# Altium schematic sheet Precharge circuit.SchDoc
size A4; SheetNumber: 7; SheetTotal: 8
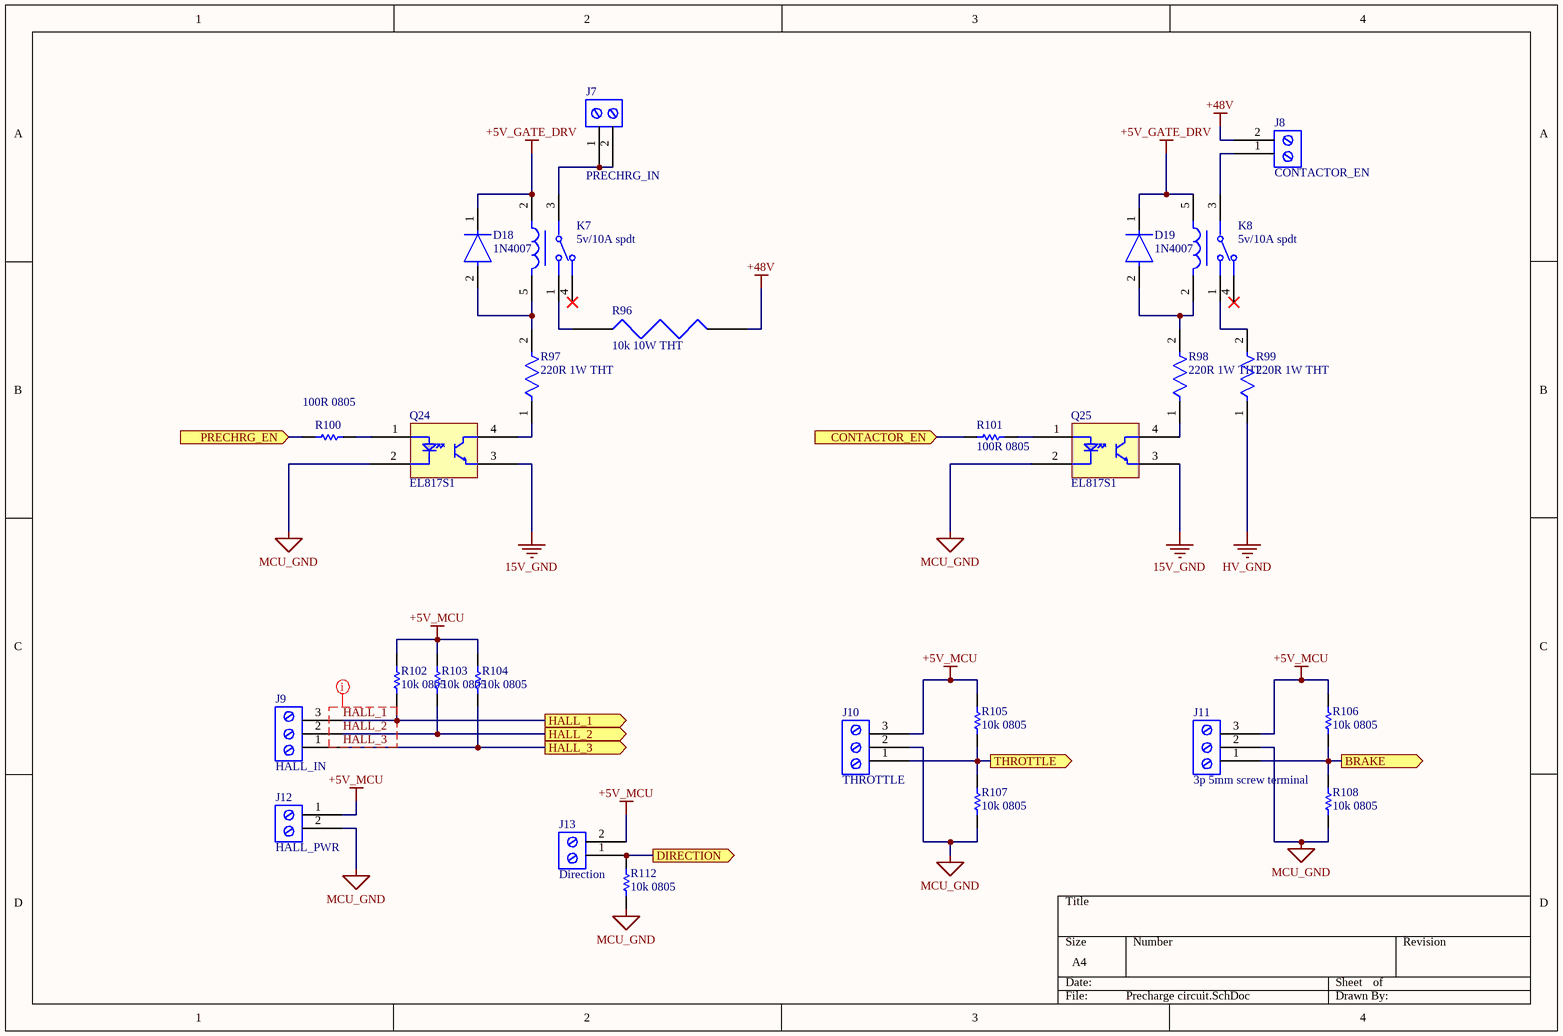
[diagram p0: Precharge circuit.SchDoc]

## Parts
D18  1N4007  [FP-1N4007-MFG]
D19  1N4007  [FP-1N4007-MFG]
J7  PRECHRG_IN  [TERMINAL_5MM_2P]
J8  CONTACTOR_EN  [TERMINAL_5MM_2P]
J9  HALL_IN  [TERMINAL_5MM_3P]
J10  THROTTLE  [TERMINAL_5MM_3P]
J11  3p 5mm screw terminal  [TERMINAL_5MM_3P]
J12  HALL_PWR  [TERMINAL_5MM_2P]
J13  Direction  [TERMINAL_5MM_2P]
K7  5v/10A spdt  [FP-G5LE-1-E-36-DC5-MFG]
K8  5v/10A spdt  [FP-G5LE-1-E-36-DC5-MFG]
Q24  EL817S1  [EL817S1]
Q25  EL817S1  [EL817S1]
R96  10k 10W THT  [R10W]
R97  220R 1W THT  [R1WTHT]
R98  220R 1W THT  [R1WTHT]
R99  220R 1W THT  [R1WTHT]
R100  100R 0805  [R0805]
R101  100R 0805  [R0805]
R102  10k 0805  [R0805]
R103  10k 0805  [R0805]
R104  10k 0805  [R0805]
R105  10k 0805  [R0805]
R106  10k 0805  [R0805]
R107  10k 0805  [R0805]
R108  10k 0805  [R0805]
R112  10k 0805  [R0805]

## Ports
BRAKE (out), CONTACTOR_EN (in), DIRECTION (out), HALL_1 (out), HALL_2 (out), HALL_3 (out), PRECHRG_EN (in), THROTTLE (out)

## Nets
15V_GND: Q24.3(E) Q25.3(E)
+5V_GATE_DRV: D18.1(C) D19.1(C) K7.2 K8.5
+5V_MCU: J10.3 J11.3 J12.1 J13.2 R102.2 R103.2 R104.2 R105.2 R106.2
+48V: J8.2 R96.2
HV_GND: R99.1
MCU_GND: J10.2 J11.2 J12.2 Q24.2(K) Q25.2(K) R107.1 R108.1 R112.1
BRAKE: J11.1 R106.1 R108.2 ; port BRAKE
CONTACTOR_EN: R101.1 ; port CONTACTOR_EN
DIRECTION: J13.1 R112.2 ; port DIRECTION
HALL_1: J9.3 R102.1 ; port HALL_1
HALL_2: J9.2 R103.1 ; port HALL_2
HALL_3: J9.1 R104.1 ; port HALL_3
PRECHRG_EN: R100.1 ; port PRECHRG_EN
THROTTLE: J10.1 R105.1 R107.2 ; port THROTTLE
NetD18_2: D18.2(A) K7.5 R97.2
NetD19_2: D19.2(A) K8.2 R98.2
NetJ7_1: J7.1 J7.2 K7.3
NetJ8_1: J8.1 K8.3
NetK7_1: K7.1 R96.1
NetK8_1: K8.1 R99.2
NetQ24_1: Q24.1(A) R100.2
NetQ24_4: Q24.4(C) R97.1
NetQ25_1: Q25.1(A) R101.2
NetQ25_4: Q25.4(C) R98.1

Not connected (* = marked no-connect by the designer): K7 4*; K8 4*

## Layout directives
rule Matched Net Lengths [Tolerance = 1mm]; net class HALL: HALL_1, HALL_2, HALL_3

## Library data of the parts
D18 D19 = CMP-123542-000001-1: GOOD-ARK 1N4007 General Purpose Rectifier Diode – DO-41 Package; Manufacturer: Diotec; Max Surge Forward Current: 27A; Forward Current: 1A; Max Junction Temp: +175°C; Reverse Voltage: 1000V; Value: 15pF; Peak Reverse Current: 5uA; Category: Diode; Temperature Range Low: -50°C; Automotive: No; Temperature: -50°C to +175°C; Lead Free: Yes; ComponentLink2Description: Datasheet; Max Repetitive Reverse Voltage: 1000V; ComponentLink2URL: https://datasheet.octopart.com/1N4007-Diotec-datasheet-62346875.pdf; Manufacturer Part Number: 1N4007; Device Class L3: Rectifier Diodes; Height: 2.8mm; Octopart: https://octopart.com/1n4007-diotec-4040411; Package: 1N4007; Temperature Range High: +175°C; Device Class L1: Discrete Semiconductors; Device Class L2: Diodes; RoHS: TRUE; Capacitance: 15pF; Ipc Land Pattern Name: DIOAD888W100L520D280; Product URL: https://sharvielectronics.com/product/good-ark-1n4007-general-purpose-rectifier-diode-do-41-package/; Price per piece: 1.29; Datasheet: https://sharvielectronics.com/wp-content/uploads/2020/02/1N4007-Diode-Good-Ark.pdf
J7 J8 J12 J13 = 2p 5mm screw terminal: XY127- 2 Pin Screw Terminal- 5mm Pitch; Product URL: https://sharvielectronics.com/product/2-pin-screw-terminal-block-red-5mm-pitch/; Price per piece: 6.32; Datasheet: https://sharvielectronics.com/wp-content/uploads/2023/03/XY127.pdf
J9-J11 = 3p 5mm screw terminal: XY127- 3 Pin Screw Terminal- 5mm Pitch; Product URL: https://sharvielectronics.com/product/xy127-3-pin-screw-terminal-5mm-pitch/; Price per piece: 8.35; Datasheet: https://sharvielectronics.com/wp-content/uploads/2023/03/XY127.pdf
K7 K8 = CMP-08822-000056-1: HF3FF/005-1ZST – 05V 10A SPDT Relay – Hongfa; Coil Voltage (DC): 5V; Coil Type: Non-Latching; Relay Type: General Purpose; Power Consumption: 400mW; Coil Resistance: 70R; Release Time: 5ms; Coil Current: 72mA; Coil Power: 360mW; Operate Time: 10ms; Contact Current Rating: 16A; Max Operating Temperature: 85°C; Contact Material: Tin; Package Quantity: 100; Throw Configuration: SPDT; Termination: PC Pin; Series: G5LE-E; Packaging: Tray; Min Operating Temperature: -40°C; Mount: Through Hole; Price per piece: 29.23; Product URL: https://sharvielectronics.com/product/hf3ff-005-1zst-05v-10a-spdt-relay-hongfa/; Datasheet: https://drive.google.com/file/d/1_hoLs5DHKocXjc-HuLXelOv-fi3k6HGm/view?usp=sharing
Q24 Q25 = EL817S1: EL817S1 (B) (TU) – F Optocoupler SMD-4 Cut Tape; Product URL: https://sharvielectronics.com/product/el817s1-b-tu-f-optocoupler-smd-4-cut-tape/; Price per piece: 7.45; Datasheet: https://sharvielectronics.com/wp-content/uploads/2021/09/EL817-Optocoupler.pdf
R96 = 10k_10W_THT: 10K ohm 10W Fusible Cement Resistor; Price per piece: 20; Product URL: https://sharvielectronics.com/product/10k-ohm-10w-fusible-cement-resistor/; Datasheet: *
R97-R99 = 220R 1W THT: 220 Ohm 1 Watt Resistor 5% Tolerance; Price per piece: 1.46; Product URL: https://sharvielectronics.com/product/220-ohm-1-watt-resistor-5-tolerance/; Datasheet: *
R100 R101 = 100R 0805: 100 ohm 1/4W Resistor 0805 Package; Price per piece: 0.82; Product URL: https://sharvielectronics.com/product/100-ohm-1-4w-resistor-0805-package/; Datasheet: *
R102-R108 R112 = 10k 0805: 10K Ohm 1/8 Watt Resistor 1% Tolerance RC0805FR-0710KL – 0805 Package; Price per piece: 0.82; Product URL: https://sharvielectronics.com/product/10k-ohm-1-8-watt-resistor-1-tolerance-rc0805fr-0710kl-0805-package/; Datasheet: https://drive.google.com/file/d/1pkLQT_RQ1i35oFQcGREpZr7Oy3Ppi-ZT/view?usp=sharing